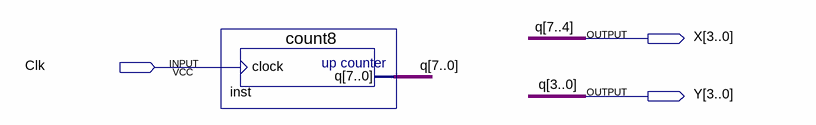
[diagram p0: schematic sheet]
// Quartus schematic testcounter.bdf as structural Verilog: 1 symbols, 3 pins
module testcounter (
  input  Clk,
  output [3:0] X,
  output [3:0] Y
);

  count8 inst (.clock(Clk), .q({X, Y}));

  // Other names for the same wires on the sheet: q[7:0] = {X, Y}
endmodule
